# EAGLE design nopi (EAGLE 9.6.2)
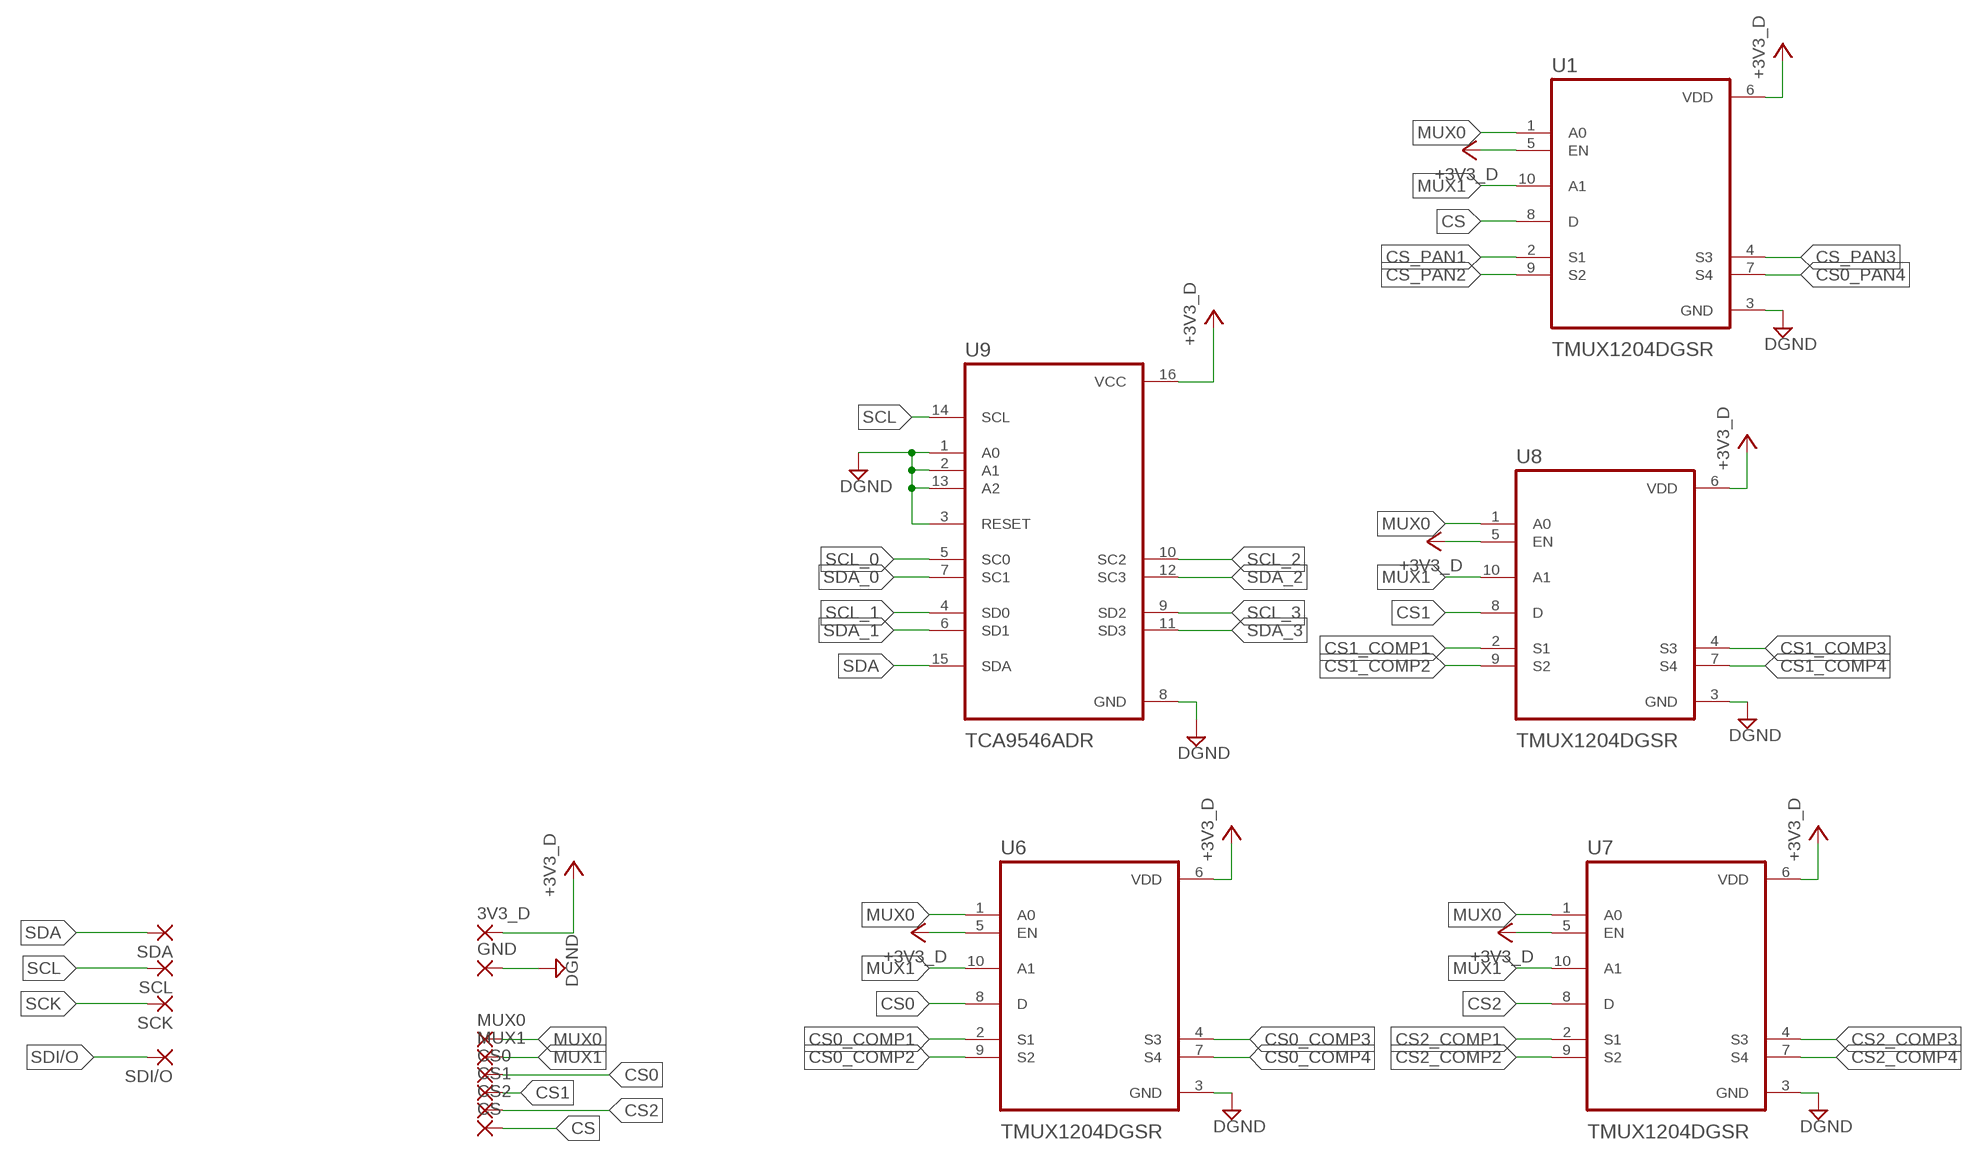
[diagram p0: schematic, sheet 1]

## Parts
3V3_D  SMD2  [SMD1,27-2,54]
CS  SMD2  [SMD1,27-2,54]
CS0  SMD2  [SMD1,27-2,54]
CS1  SMD2  [SMD1,27-2,54]
CS2  SMD2  [SMD1,27-2,54]
GND  SMD2  [SMD1,27-2,54]
MUX0  SMD2  [SMD1,27-2,54]
MUX1  SMD2  [SMD1,27-2,54]
SCK  SMD2  [SMD1,27-2,54]
SCL  SMD2  [SMD1,27-2,54]
SDA  SMD2  [SMD1,27-2,54]
SDI/O  SMD2  [SMD1,27-2,54]
U1  TMUX1204DGSR  [SOP50P490X110-10N]
U6  TMUX1204DGSR  [SOP50P490X110-10N]
U7  TMUX1204DGSR  [SOP50P490X110-10N]
U8  TMUX1204DGSR  [SOP50P490X110-10N]
U9  TCA9546ADR  [SOIC127P600X175-16N]

## Nets
+3V3: 3V3_D.1(P) U1.5(EN) U1.6(VDD) U6.5(EN) U6.6(VDD) U7.5(EN) U7.6(VDD) U8.5(EN) U8.6(VDD) U9.16(VCC) ; supply symbol labelled +3V3_D
CS: CS.1(P) U1.8(D)
CS0: CS0.1(P) U6.8(D)
CS0_COMP1: U6.2(S1)
CS0_COMP2: U6.9(S2)
CS0_COMP3: U6.4(S3)
CS0_COMP4: U6.7(S4)
CS0_PAN4: U1.7(S4)
CS1: CS1.1(P) U8.8(D)
CS1_COMP1: U8.2(S1)
CS1_COMP2: U8.9(S2)
CS1_COMP3: U8.4(S3)
CS1_COMP4: U8.7(S4)
CS2: CS2.1(P) U7.8(D)
CS2_COMP1: U7.2(S1)
CS2_COMP2: U7.9(S2)
CS2_COMP3: U7.4(S3)
CS2_COMP4: U7.7(S4)
CS_PAN1: U1.2(S1)
CS_PAN2: U1.9(S2)
CS_PAN3: U1.4(S3)
DGND: GND.1(P) U1.3(GND) U6.3(GND) U7.3(GND) U8.3(GND) U9.1(A0) U9.2(A1) U9.3(RESET) U9.8(GND) U9.13(A2)
MUX0: MUX0.1(P) U1.1(A0) U6.1(A0) U7.1(A0) U8.1(A0)
MUX1: MUX1.1(P) U1.10(A1) U6.10(A1) U7.10(A1) U8.10(A1)
SCK: SCK.1(P)
SCL: SCL.1(P) U9.14(SCL)
SCL_0: U9.5(SC0)
SCL_1: U9.4(SD0)
SCL_2: U9.10(SC2)
SCL_3: U9.9(SD2)
SDA: SDA.1(P) U9.15(SDA)
SDA_0: U9.7(SC1)
SDA_1: U9.6(SD1)
SDA_2: U9.12(SC3)
SDA_3: U9.11(SD3)
SDI/O: SDI/O.1(P)

## Library data of the parts
3V3_D CS CS0 CS1 CS2 GND MUX0 MUX1 SCK SCL SDA SDI/O = wirepad:SMD2: SMD PAD
U1 U6-U8 = TMUX1204DGSR:TMUX1204DGSR: Check availability <https://pricing.snapeda.com/parts/TMUX1204DGSR/Texas%20Instruments/view-part?ref=eda>; AVAILABILITY: In Stock; CHECK_PRICES: https://www.snapeda.com/parts/TMUX1204DGSR/Texas+Instruments/view-part/?ref=eda; DESCRIPTION: 5-V, 4:1, 1-channel, general-purpose analog multiplexer; MF: Texas Instruments; MP: TMUX1204DGSR; PACKAGE: VSSOP-10 Texas Instruments; PRICE: None; PURCHASE-URL: https://www.snapeda.com/api/url_track_click_mouser/?unipart_id=3657556&manufacturer=Texas Instruments&part_name=TMUX1204DGSR&search_term=tmux1204; SNAPEDA_LINK: https://www.snapeda.com/parts/TMUX1204DGSR/Texas+Instruments/view-part/?ref=snap
U9 = TCA9546ADR:TCA9546ADR: Check availability <https://pricing.snapeda.com/parts/TCA9546ADR/Texas%20Instruments/view-part?ref=eda>; AVAILABILITY: In Stock; CHECK_PRICES: https://www.snapeda.com/parts/TCA9546ADR/Texas+Instruments/view-part/?ref=eda; DESCRIPTION: 4-channel 1.65- to 5.5-V I2C/SMBus switch with reset & voltage translation; MF: Texas Instruments; MP: TCA9546ADR; PACKAGE: SOIC-16 Texas Instruments; PRICE: None; PURCHASE-URL: https://www.snapeda.com/api/url_track_click_mouser/?unipart_id=424331&manufacturer=Texas Instruments&part_name=TCA9546ADR&search_term=None; SNAPEDA_LINK: https://www.snapeda.com/parts/TCA9546ADR/Texas+Instruments/view-part/?ref=snap

## Board
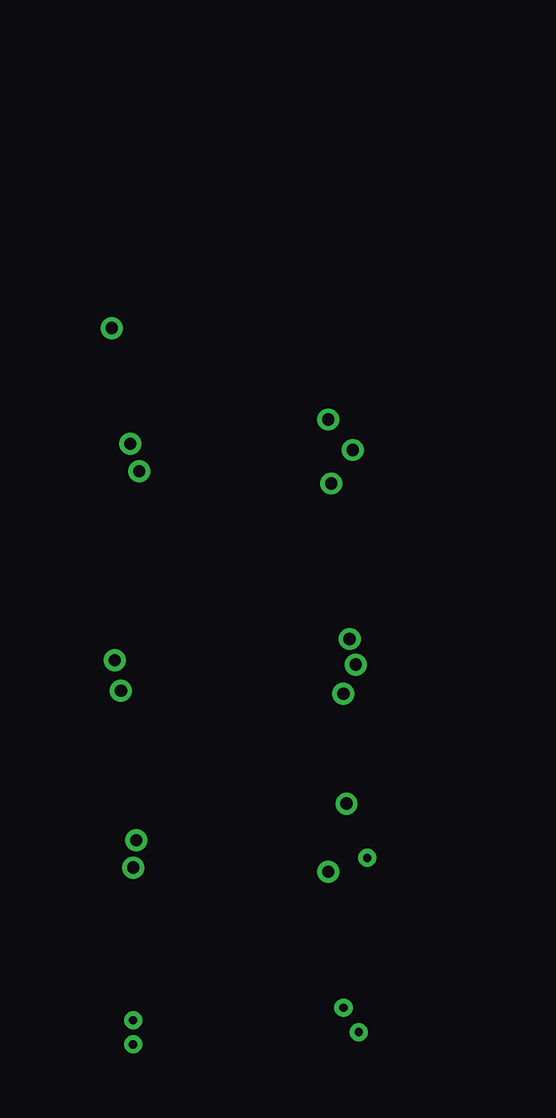
[diagram p1: board, top side]
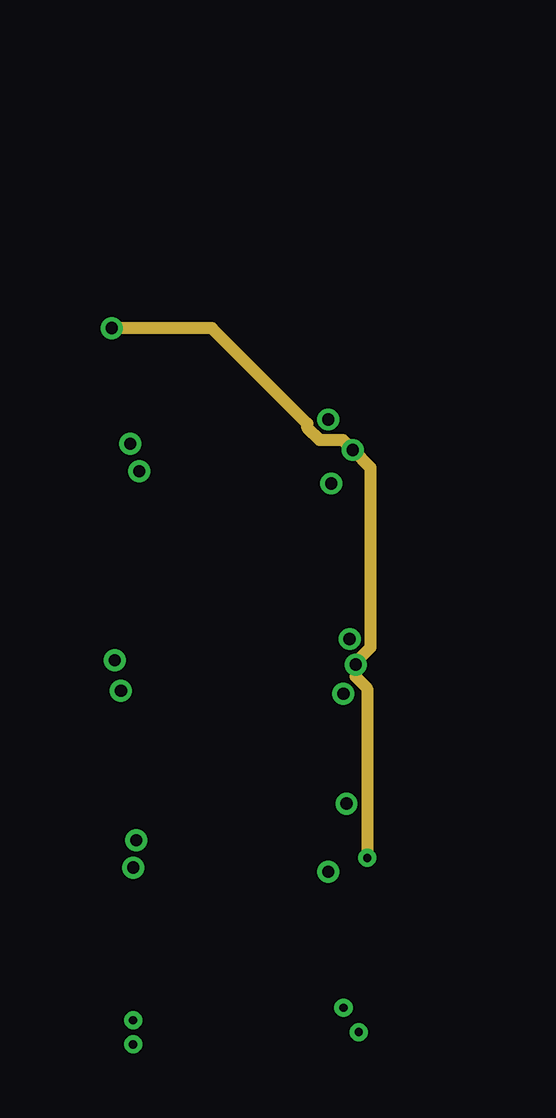
[diagram p2: board, inner layer Route2]
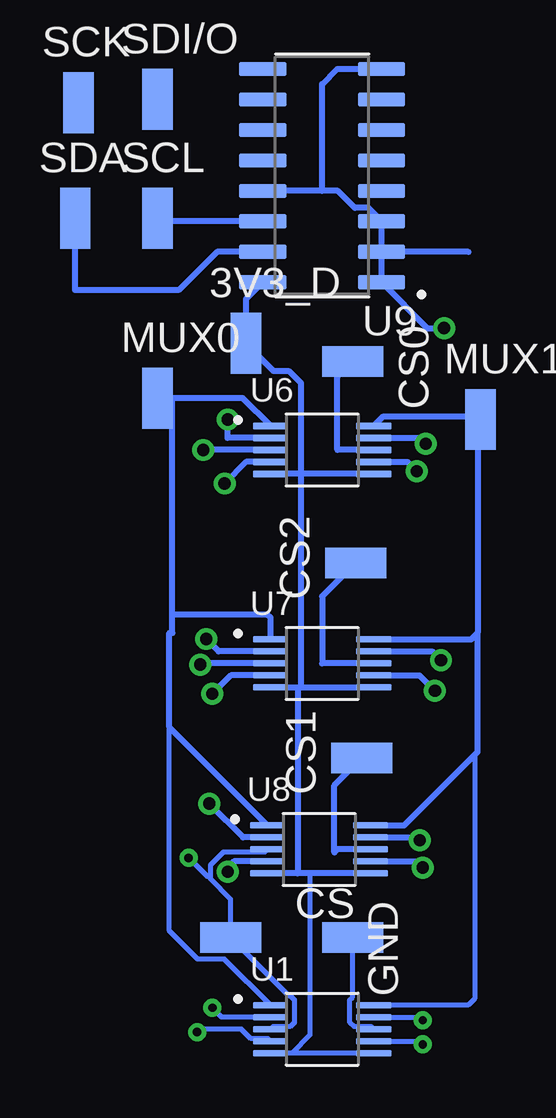
[diagram p3: board, bottom side, seen from below]

No outline drawn. Coordinates in mm, seen from the top.
Copper layers (1+2*15+16): Top 0.035mm / dielectric 1.5mm / Route2 0.035mm / dielectric 0.15mm / Route15 0.035mm / dielectric 0.2mm / Bottom 0.035mm
Design rules "default *": minimum track width 6mil, minimum drill 0.35mm, track to track 6mil, track to pad 6mil, pad to pad 6mil, via to via 6mil, smd to smd 6mil, copper to edge 40mil, drill to drill 6mil, minimum pad ring 10mil, minimum via ring 8mil, stop-mask expansion 4mil, vias tented up to drill 0mil, thermal gap 10mil

### Footprints (pad centres in the part's own frame; a part is rotated, then mirrored left to right if it is on the bottom)
SMD1,27-2,54 = smd 1.27 x 2.54: 1 0,0
SOP50P490X110-10N = smd 1.47 x 0.28: 1 -2.15,1; 2 -2.15,0.5; 3 -2.15,0; 4 -2.15,-0.5; 5 -2.15,-1; 6 2.15,-1; 7 2.15,-0.5; 8 2.15,0; 9 2.15,0.5; 10 2.15,1
SOIC127P600X175-16N = smd 1.97 x 0.6: 1 -2.475,4.445; 2 -2.475,3.175; 3 -2.475,1.905; 4 -2.475,0.635; 5 -2.475,-0.635; 6 -2.475,-1.905; 7 -2.475,-3.175; 8 -2.475,-4.445; 9 2.475,-4.445; 10 2.475,-3.175; 11 2.475,-1.905; 12 2.475,-0.635; 13 2.475,0.635; 14 2.475,1.905; 15 2.475,3.175; 16 2.475,4.445

### Placement (x,y rotation side)
3V3_D  13.34,24.77 0 bottom
CS  8.89,0 270 bottom
CS0  8.89,24 270 bottom
CS1  8.51,7.49 90 bottom
CS2  8.76,15.62 90 bottom
GND  13.97,0 270 bottom
MUX0  17.02,22.48 0 bottom
MUX1  3.56,21.59 0 bottom
SCK  20.32,34.8 0 bottom
SCL  17.02,29.97 0 bottom
SDA  20.45,29.97 0 bottom
SDI/O  17.02,34.92 0 bottom
U1  10.16,-3.81 0 bottom
U6  10.16,20.32 0 bottom
U7  10.16,11.43 0 bottom
U8  10.29,3.68 0 bottom
U9  10.16,31.75 180 bottom

### Tracks (layer width: path | path; a pad name or v marks a point on that pad's centre or on a via)
+3V3
  Bottom 0.203: U1.6 11.43,-4.81 | 11.43,-4.81 U1.5 | 10.67,2.68 10.67,-4.05 11.43,-4.81
  Bottom 0.254: U8.6 10.67,2.68 11.18,2.68 | 11.18,2.68 U8.5 | U7.5 11.18,10.43 | 11.18,10.43 11.05,10.43 | 11.05,10.43 U7.6 | U6.6 11.05,19.32 | 11.05,19.32 U6.5 | 11.05,19.32 11.05,10.43 | 11.18,10.43 11.18,2.68 | U9.16 13.34,26.61 3V3_D.1 12.19,23.62 11.56,23.62 11.05,23.11 11.05,19.32
CS
  Bottom 0.203: U1.8 8.12,-3.7 8.83,-3.7 9,-3.54 9,-2.58 8.89,-2.48 CS.1
CS0
  Bottom 0.254: U6.8 9.53,20.32 9.53,23.37 CS0.1
CS0_COMP1  (via drill 0.51)
  Bottom 0.254: U6.2 14.1,20.82 v14.1,21.59
CS0_COMP2  (via drill 0.51)
  Bottom 0.254: U6.9 6.09,20.82 v5.84,20.57
CS0_COMP3  (via drill 0.51)
  Bottom 0.254: U6.4 13.33,19.82 v14.22,18.92
CS0_COMP4  (via drill 0.51)
  Bottom 0.254: U6.7 6.61,19.82 v6.22,19.43
CS0_PAN4  (via drill 0.35)
  Bottom 0.203: U1.7 6.1,-4.31 v5.97,-4.45
CS1
  Bottom 0.254: U8.8 9.53,3.68 9.65,3.56 9.65,6.35 CS1.1
CS1_COMP1  (via drill 0.51)
  Bottom 0.254: U8.2 13.45,4.18 v14.86,5.59
CS1_COMP2  (via drill 0.51)
  Bottom 0.254: U8.9 6.21,4.18 v6.1,4.06
CS1_COMP3  (via drill 0.51)
  Bottom 0.254: U8.4 13.84,3.18 14.1,2.92 v14.1,2.74
CS1_COMP4  (via drill 0.51)
  Bottom 0.254: U8.7 8.13,3.17 6.22,3.17 v5.97,2.92
CS2
  Bottom 0.254: U7.8 10.16,11.43 10.16,14.22 CS2.1
CS2_COMP1  (via drill 0.51)
  Bottom 0.254: U7.2 14.47,11.93 v14.99,12.45
CS2_COMP2  (via drill 0.51)
  Bottom 0.254: U7.9 5.58,11.93 v5.21,11.56
CS2_COMP3  (via drill 0.51)
  Bottom 0.254: U7.4 13.96,10.93 v14.73,10.16
CS2_COMP4  (via drill 0.51)
  Bottom 0.254: U7.7 6.1,10.93 v5.46,10.29
CS_PAN1  (via drill 0.35)
  Bottom 0.203: U1.2 14.34,-3.31 v14.73,-2.92
CS_PAN2  (via drill 0.35)
  Bottom 0.203: U1.9 6.09,-3.31 5.97,-3.43 v5.97,-3.44
CS_PAN3  (via drill 0.35)
  Bottom 0.203: U1.4 12.42,-4.2 13.13,-4.2 13.53,-3.81 15.24,-3.81 v15.37,-3.94
DGND  (via drill 0.35, 0.51)
  Route2 0.508: v15.72,3.33 15.72,10.39 15.24,10.87 v15.24,11.38 15.24,11.48 15.85,12.09 15.85,19.58 v15.11,20.32 14.71,20.73 13.74,20.73 13.23,21.23 13.23,21.42 9.25,25.4 v5.08,25.4
  Bottom 0.203: U1.3 12.2,-3.7 11.49,-3.7 11.32,-3.54 11.32,-2.58 11.49,-2.42 11.55,-2.42 GND.1 13.97,1.61 14.81,2.45 14.81,2.54 | 14.81,2.54 14.81,3.04 14.27,3.58 12.54,3.58 U8.3 | 14.81,2.54 14.94,2.54 v15.72,3.33
  Bottom 0.254: U9.2 U9.3 8.25,30.41 8.79,30.41 9.5,31.11 10.16,31.11 | U9.2 U9.1 5.78,25.4 v5.08,25.4 | 10.16,31.11 U9.13 | 10.16,31.11 10.16,35.56 9.53,36.2 U9.8 | 4.06,28.57 U9.2 | U7.3 15.24,11.43 v15.24,11.38 | U6.3 v15.11,20.32
MUX0
  Bottom 0.203: U1.1 14.23,-0.89 15.35,-0.89 16.52,0.29 16.52,8.77
  Bottom 0.254: U6.1 13.47,22.48 MUX0.1 16.39,22.48 16.39,13.46 | 16.39,13.46 12.44,13.46 12.31,13.34 U7.1 | U8.1 16.52,8.77 16.52,12.7 16.39,12.7 16.39,13.46
MUX1
  Bottom 0.203: 3.81,7.62 3.81,-2.54 4.08,-2.81 U1.10
  Bottom 0.254: 3.68,21.72 3.7,21.7 3.59,21.59 MUX1.1 | 3.68,21.72 7.61,21.72 U6.10 | 3.68,21.72 3.68,12.7 | 3.68,12.7 3.95,12.43 U7.10 | 3.68,12.7 3.68,7.75 3.81,7.62 6.75,4.68 U8.10
SCL
  Bottom 0.254: U9.14 16.45,29.84 17.02,29.27 SCL.1
SDA
  Bottom 0.254: U9.15 14.54,28.57 16.14,26.98 20.45,26.98 SDA.1